# EAGLE design YosanoLoveButton (EAGLE 7.7.0)
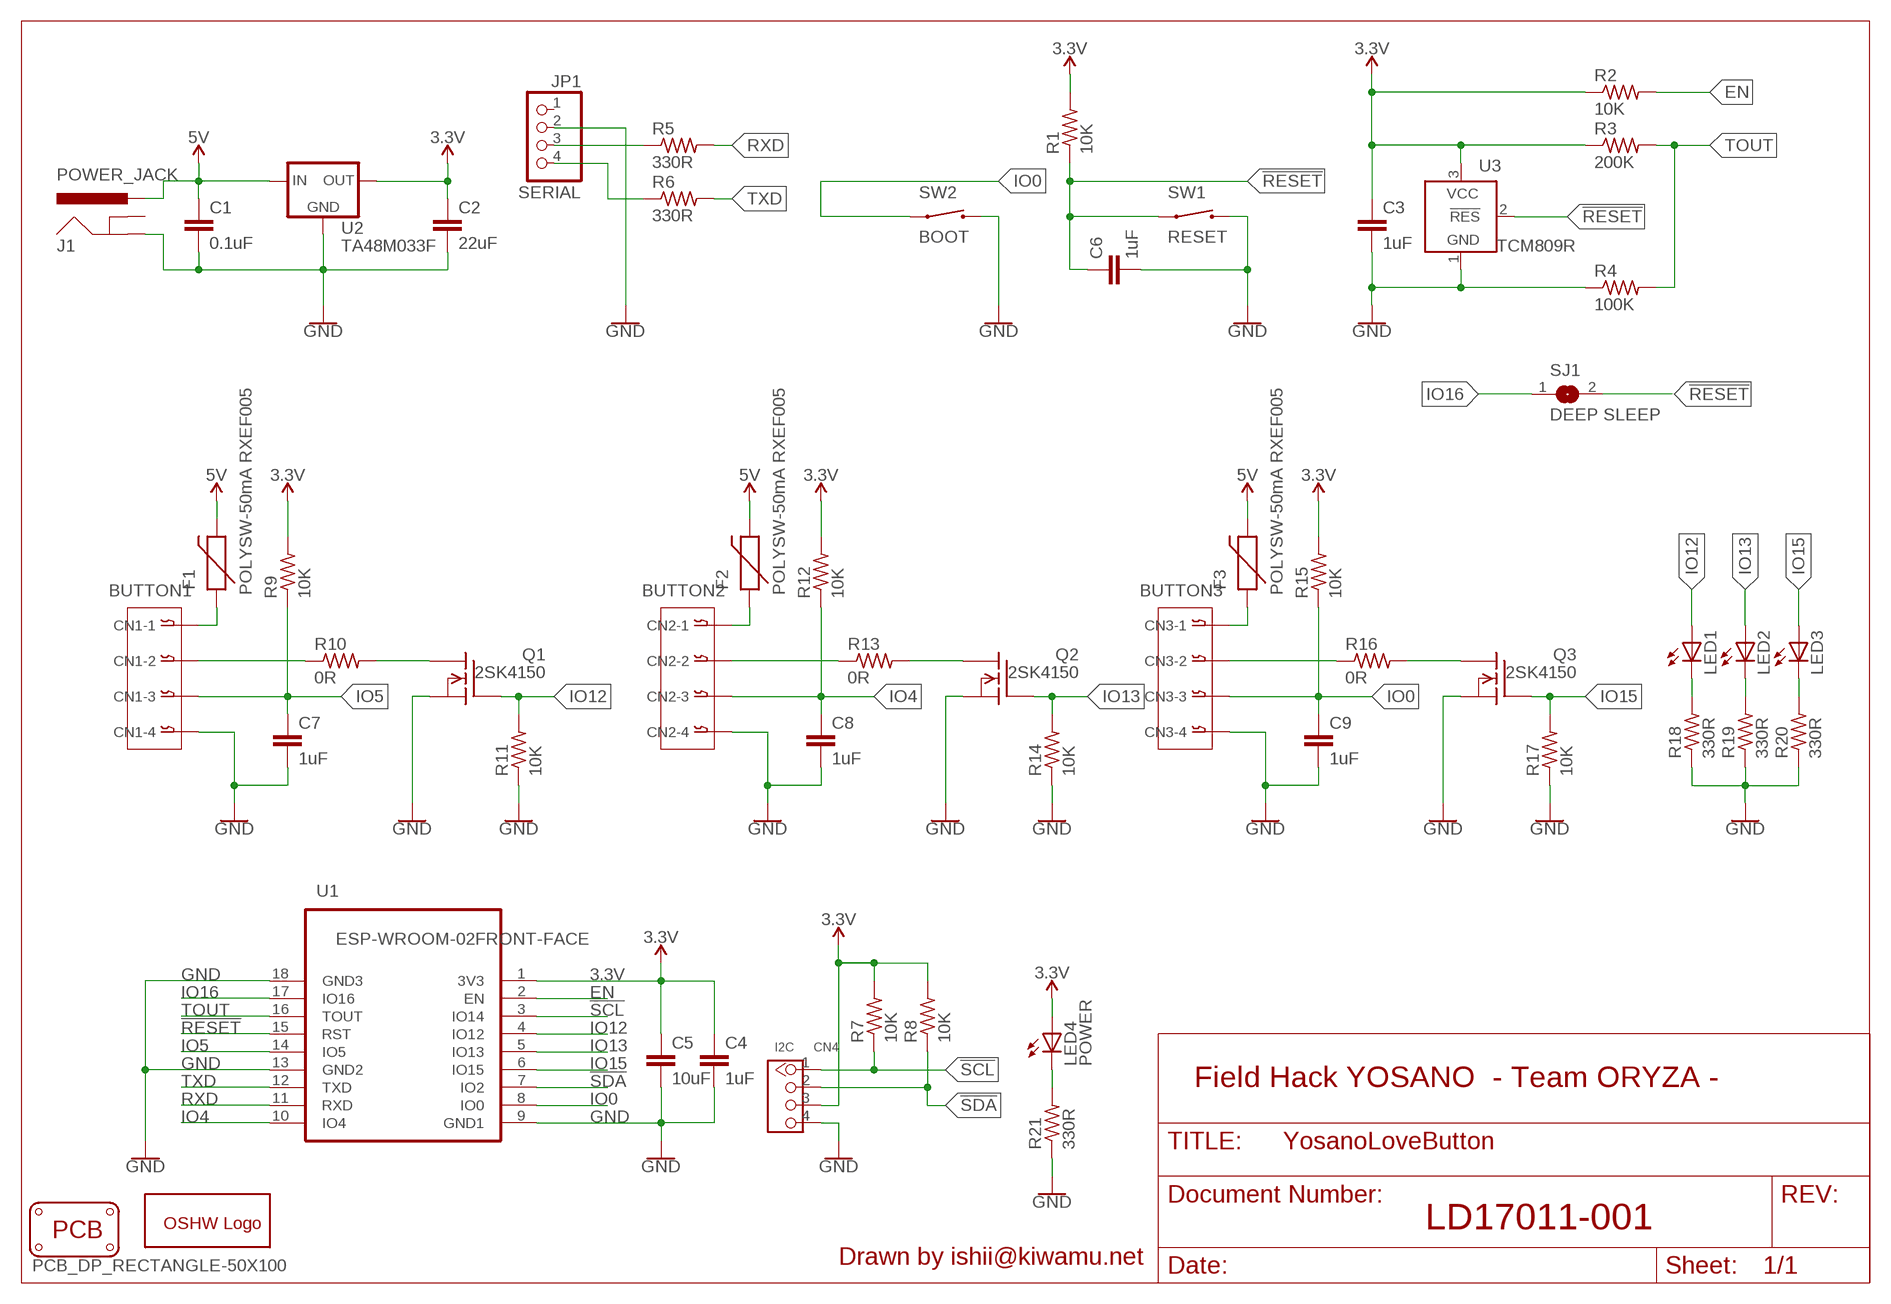
[diagram p0: schematic, sheet 1]

## Parts
C1  0.1uF  C5/2.5  [C5B2.5]
C2  22uF  C5/2.5  [C5B2.5]
C3  1uF  C5/2.5  [C5B2.5]
C4  1uF  C5/2.5  [C5B2.5]
C5  10uF  C5/2.5  [C5B2.5]
C6  1uF  C5/2.5  [C5B2.5]
C7  1uF  C5/2.5  [C5B2.5]
C8  1uF  C5/2.5  [C5B2.5]
C9  1uF  C5/2.5  [C5B2.5]
CN1  BUTTON1  04-JST-B4B-XH-A  [B4B-XH]
CN2  BUTTON2  04-JST-B4B-XH-A  [B4B-XH]
CN3  BUTTON3  04-JST-B4B-XH-A  [B4B-XH]
CN4  I2C  GROVE-CONNECTOR-DIP(4P-2.0)  [HW4-2.0]
F1  POLYSW-50mA RXEF005  PTCPTH  [PTC]
F2  POLYSW-50mA RXEF005  PTCPTH  [PTC]
F3  POLYSW-50mA RXEF005  PTCPTH  [PTC]
GOLD_ORB_SM1  OSHWLOGOLOGO5MM  [OSHW_5MM]
J1  POWER_JACK  [POWER_JACK_PTH]
JP1  SERIAL  PINHD-1X4  [1X04]
LED1  LED3MM  [LED3MM]
LED2  LED3MM  [LED3MM]
LED3  LED3MM  [LED3MM]
LED4  POWER  LED3MM  [LED3MM]
PCB1  PCB_DP_RECTANGLE-50X100  [DP10050_V1]
Q1  2SK4150  BSS101  [TO92]
Q2  2SK4150  BSS101  [TO92]
Q3  2SK4150  BSS101  [TO92]
R1  10K  R-US_0204/7  [0204/7]
R2  10K  R-US_0204/7  [0204/7]
R3  200K  R-US_0204/7  [0204/7]
R4  100K  R-US_0204/7  [0204/7]
R5  330R  R-US_0204/7  [0204/7]
R6  330R  R-US_0204/7  [0204/7]
R7  10K  R-US_0204/7  [0204/7]
R8  10K  R-US_0204/7  [0204/7]
R9  10K  R-US_0204/7  [0204/7]
R10  0R  R-US_0204/7  [0204/7]
R11  10K  R-US_0204/7  [0204/7]
R12  10K  R-US_0204/7  [0204/7]
R13  0R  R-US_0204/7  [0204/7]
R14  10K  R-US_0204/7  [0204/7]
R15  10K  R-US_0204/7  [0204/7]
R16  0R  R-US_0204/7  [0204/7]
R17  10K  R-US_0204/7  [0204/7]
R18  330R  R-US_0204/7  [0204/7]
R19  330R  R-US_0204/7  [0204/7]
R20  330R  R-US_0204/7  [0204/7]
R21  330R  R-US_0204/7  [0204/7]
SJ1  DEEP SLEEP  SOLDERJUMPERREFLOW  [SOLDERJUMPER_REFLOW]
SW1  RESET  TVBP06  [TVBP06]
SW2  BOOT  TVBP06  [TVBP06]
U1  ESP-WROOM-02FRONT-FACE  [FRONT-FACE]
U2  TA48M033F  [DPACK]
U3  TCM809R  TCM809  [SOT23B-3]

## Nets
3.3V [pwr]: C2.1 C3.1 C4.1 C5.1 CN4.3 LED4.A R1.2 R2.1 R3.1 R7.2 R8.2 R9.2 R12.2 R15.2 U1.1(3V3) U2.3(OUT) U3.3(VCC)
5V [pwr]: C1.1 F1.P$2 F2.P$2 F3.P$2 J1.PWR U2.1(IN)
!RESET: C6.1 R1.1 SJ1.2 SW1.1 U1.15(RST) U3.2(!RES)
!SCL: CN4.1 R7.1 U1.3(IO14)
!SDA: CN4.2 R8.1 U1.7(IO2)
EN: R2.2 U1.2(EN)
GND [gnd]: C1.2 C2.2 C3.2 C4.2 C5.2 C6.2 C7.2 C8.2 C9.2 CN1.P$4 CN2.P$4 CN3.P$4 CN4.4 J1.GND JP1.2 Q1.1(S) Q2.1(S) Q3.1(S) R4.1 R11.1 R14.1 R17.1 R18.1 R19.1 R20.1 R21.1 SW1.2 SW2.2 U1.9(GND1) U1.13(GND2) U1.18(GND3) U2.4(GND) U3.1(GND)
IO0: C9.1 CN3.P$3 R15.1 SW2.1 U1.8(IO0)
IO4: C8.1 CN2.P$3 R12.1 U1.10(IO4)
IO5: C7.1 CN1.P$3 R9.1 U1.14(IO5)
IO12: LED1.A Q1.2(G) R11.2 U1.4(IO12)
IO13: LED2.A Q2.2(G) R14.2 U1.5(IO13)
IO15: LED3.A Q3.2(G) R17.2 U1.6(IO15)
IO16: SJ1.1 U1.17(IO16)
N$1: LED1.K(C) R18.2
N$2: LED4.K(C) R21.2
N$3: JP1.4 R6.1
N$4: Q1.3(D) R10.2
N$5: JP1.3 R5.1
N$6: LED2.K(C) R19.2
N$7: LED3.K(C) R20.2
N$8: CN1.P$1 F1.P$1
N$9: CN1.P$2 R10.1
N$11: Q2.3(D) R13.2
N$12: CN2.P$1 F2.P$1
N$13: CN2.P$2 R13.1
N$15: Q3.3(D) R16.2
N$18: CN3.P$1 F3.P$1
N$19: CN3.P$2 R16.1
RXD: R5.2 U1.11(RXD)
TOUT: R3.2 R4.2 U1.16(TOUT)
TXD: R6.2 U1.12(TXD)
Unconnected: J1.GNDBREAK JP1.1

## Notes on the sheet
- Field Hack YOSANO  - Team ORYZA -
- LD17011-001
- Drawn by ishii@kiwamu.net

## Library data of the parts
C1-C9 = capacitor-wima:C: CAPACITOR naming: grid - package width
CN1-CN3 = bt_con-jst-xh:04-JST: JST CONNECTOR
CN4 = Seeed-Connector -2016:GROVE-CONNECTOR-DIP(4P-2.0): 320110033; VALUE: 4P-2.0
F1-F3 = bt:PTC: Resettable Fuse PTC Resettable Fuse. Spark Fun Electronics SKU : COM-08357
GOLD_ORB_SM1 = oshw:OSHWLOGO: The OSHW logo for PCB layout
J1 = SparkFun-Connectors:POWER_JACK: Power Jack Connector This is the standard 5.5mm barrel jack for power. The PTH is the most common, proven, reliable, footprint. The Slot footprint only works if the mill layer is transmitted to the PCB fab house so be warned. Here are the connectors we sell at SparkFun: DC Barrel Power Jack/Connector <https://www.sparkfun.com/products/119> (PRT-00119) DC Barrel Power Jack/Connector (SMD) <https://www.sparkfun.com/products/12748> (PRT-12748) DC Barrel Jack Adapter - Breadboard Compatible <https://www.sparkfun.com/products/10811> (PRT-10811) It is used on this SparkFun product (and many, many others): SparkFun RedBoard - Programmed with Arduino <https://www.sparkfun.com/products/12757> (DEV-12757) Also, if you need a mating power supply or connector, please check these out: Wall Adapter Power Supply - 9VDC 650mA <https://www.sparkfun.com/products/298> (TOL-00298) DC Barrel Jack Adapter - Male <https://www.sparkfun.com/products/10287> (PRT-10287); PROD_ID: CONN-08197
JP1 = pinhead:PINHD-1X4: PIN HEADER
LED1-LED4 = adafruit:LED: LED OSRAM: - CHIPLED LG R971, LG N971, LY N971, LG Q971, LY Q971, LO R971, LY R971 LH N974, LH R974 LS Q976, LO Q976, LY Q976 LO Q996 - Hyper CHIPLED LW Q18S LB Q993, LB Q99A, LB R99A - SideLED LS A670, LO A670, LY A670, LG A670, LP A670 LB A673, LV A673, LT A673, LW A673 LH A674 LY A675 LS A676, LA A676, LO A676, LY A676, LW A676 LS A679, LY A679, LG A679 - Hyper Micro SIDELED® LS Y876, LA Y876, LO Y876, LY Y876 LT Y87S - SmartLED LW L88C, LW L88S LB L89C, LB L89S, LG L890 LS L89K, LO L89K, LY L89K LS L896, LA L896, LO L896, LY L896 - TOPLED LS T670, LO T670, LY T670, LG T670, LP T670 LSG T670, LSP T670, LSY T670, LOP T670, LYG T670 LG T671, LOG T671, LSG T671 LB T673, LV T673, LT T673, LW T673 LH T674 LS T676, LA T676, LO T676, LY T676, LB T676, LH T676, LSB T676, LW T676 LB T67C, LV T67C, LT T67C, LS T67K, LO T67K, LY T67K, LW E67C LS E67B, LA E67B, LO E67B, LY E67B, LB E67C, LV E67C, LT E67C LW T67C LS T679, LY T679, LG T679 LS T770, LO T770, LY T770, LG T770, LP T770 LB T773, LV T773, LT T773, LW T773 LH T774 LS E675, LA E675, LY E675, LS T675 LS T776, LA T776, LO T776, LY T776, LB T776 LHGB T686 LT T68C, LB T68C - Hyper Mini TOPLED® LB M676 - Mini TOPLED Santana® LG M470 LS M47K, LO M47K, LY M47K Source: http://www.osram.convergy.de/
PCB1 = dp_pcb:PCB_DP_RECTANGLE: Dangerous Prototypes Standard Rectangular PCB sizes
Q1-Q3 = transistor-fet:BSS101: N-Channel Enhancement MOSFET 200V; 0,16A; 11Ohm
R1-R21 = resistor:R-US_: RESISTOR, American symbol
SJ1 = microbuilder:SOLDERJUMPER: SMD Solder JUMPER Solder the two pads together to create a connection, or remove the solder to break it. REFLOW - Use this footprint for solder paste and reflow ovens. WAVE - Use this footprint for hand-soldering (larger pads). CLOSED - Has a trace between the two pads to ensure it is closed by default. The trace needs to be cut to disable the jumper, and can be closed again by creating a solder bridge between the two pads.
SW1 SW2 = switches:TVBP06: 2pin switch. http://akizukidenshi.com/catalog/g/gP-08074/
U1 = esp-wroom-02:ESP-WROOM-02: WiFi module - ESP-WROOM-02
U2 = BS21Lab-Regulators:TA48?*: TA48 series
U3 = telcom:TCM809: POWER SUPPLY MONITOR replacement for Maxim MAX809 and MAX810; MF: MICROCHIP; MPN: TCM809MENB713; OC_FARNELL: 9762744; OC_NEWARK: 96K3998

## Net classes
0 default: width 0.406 mm, drill 0.305 mm, clearance 0.254 mm
1 gnd: width 0.635 mm, drill 0.635 mm, clearance 0.305 mm
2 pwr: width 0.559 mm, drill 0.559 mm, clearance 0.254 mm

## Board
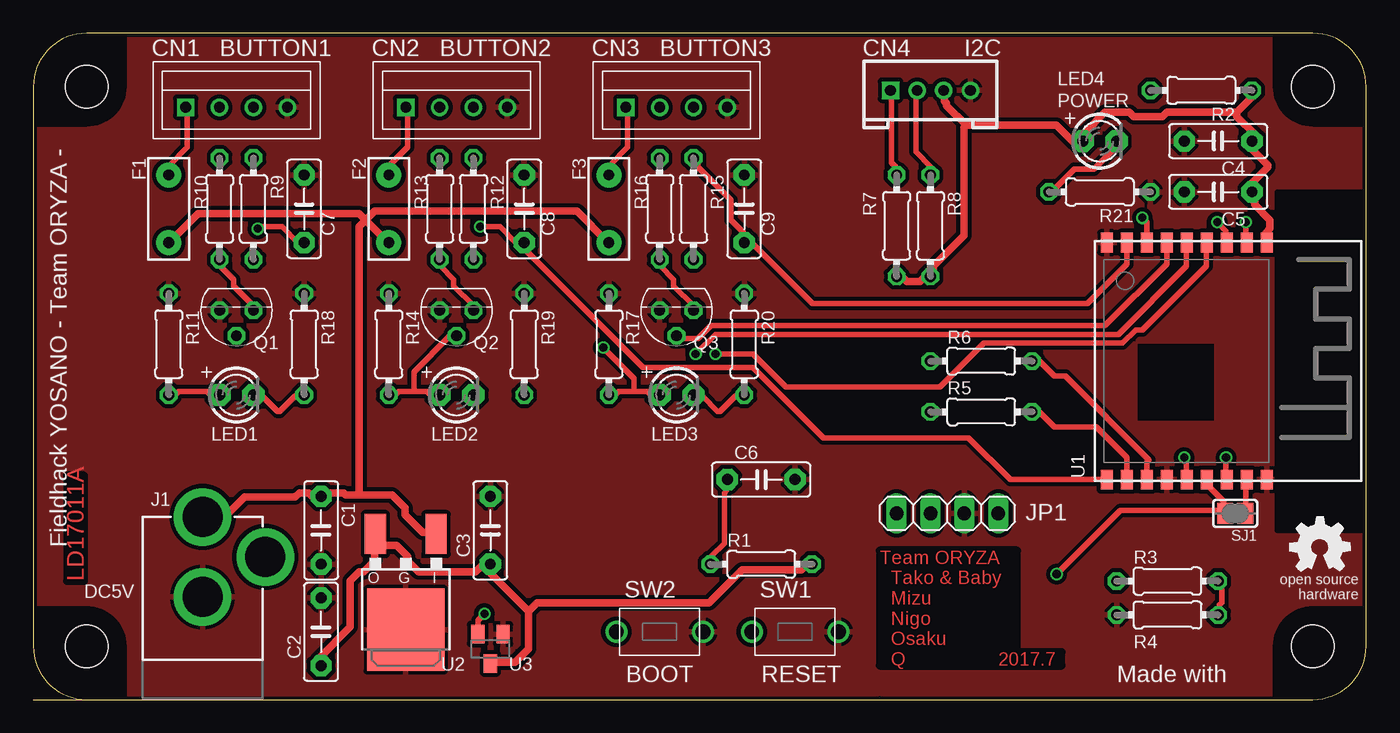
[diagram p1: board, top side]
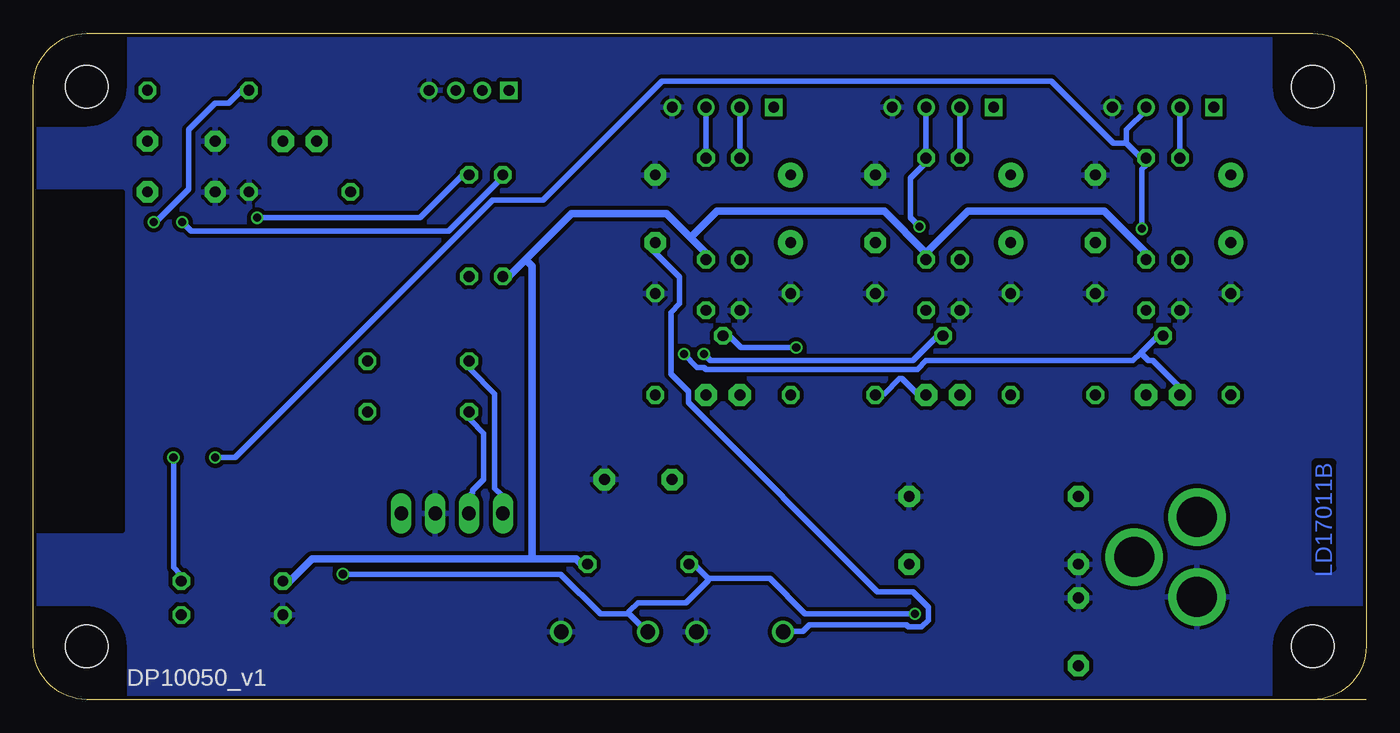
[diagram p2: board, bottom side, seen from below]

Size 100 x 50 mm. Coordinates in mm from the lower left corner, seen from the top.
Outline: 0,0 63.5,0
Copper layers (1*16): Top 0.035mm / dielectric 1.5mm / Bottom 0.035mm
Design rules "SeeedStudio_2layer_DRU_no_angle_20140221": minimum track width 6mil, minimum drill 12mil, track to track 6mil, track to pad 6mil, pad to pad 6mil, via to via 6mil, smd to smd 0mil, copper to edge 10mil, drill to drill 10mil, minimum pad ring 10mil, minimum via ring 6mil, stop-mask expansion 2mil, vias tented up to drill 100mil, thermal gap 10mil
tRestrict: area 93.3,12.7 to 99.7,38.1
bRestrict: area 93.3,12.7 to 99.7,38.1

### Footprints (pad centres in the part's own frame; a part is rotated, then mirrored left to right if it is on the bottom)
C5B2.5 = drill 0.813 pad 1.6 octagon: 1 -2.54,0; 2 2.54,0
B4B-XH = drill 0.8 square: P$1 -3.81,0 | drill 0.8: P$2 -1.27,0; P$3 1.27,0; P$4 3.81,0
HW4-2.0 = drill 0.8 pad 1.27 square: 1 -3,0 | drill 0.8 pad 1.27: 2 -1,0; 3 1,0; 4 3,0
PTC = drill 0.8 pad 1.88: P$1 -2.54,0; P$2 2.54,0
POWER_JACK_PTH = drill 2.997 pad 4.318: GND 0,7.7; GNDBREAK 4.7,10.7; PWR 0,13.7
1X04 = drill 1.016 long: 1 -3.81,0; 2 -1.27,0; 3 1.27,0; 4 3.81,0
LED3MM = drill 0.813 pad 1.676 octagon: A -1.27,0; K 1.27,0
DP10050_V1 = hole 3.2: 4,4; 96,4; 96,46; 4,46
TO92 = drill 0.813 octagon: 1 1.27,0; 2 0,1.905; 3 -1.27,0
0204/7 = drill 0.813 octagon: 1 -3.81,0; 2 3.81,0
SOLDERJUMPER_REFLOW = smd 1.168 x 1.6: 1 -0.762,0; 2 0.762,0
TVBP06 = drill 1.1: 1 -3.25,0; 2 3.25,0
FRONT-FACE = smd 1.485 x 0.9: 1 -8.893,4.9; 2 -8.893,3.4; 3 -8.893,1.9; 4 -8.893,0.4; 5 -8.893,-1.1; 6 -8.893,-2.6; 7 -8.893,-4.1; 8 -8.893,-5.6; 9 -8.893,-7.1; 10 8.893,-7.1; 11 8.893,-5.6; 12 8.893,-4.1; 13 8.893,-2.6; 14 8.893,-1.1; 15 8.893,0.4; 16 8.893,1.9; 17 8.893,3.4; 18 8.893,4.9
DPACK = smd 1.6 x 3: 1 -2.28,-4.8; 3 2.28,-4.8 | smd 5.8 x 6.2: 4 0,2.38
SOT23B-3 = smd 1 x 1.4: 1 -0.95,-1.1; 2 0.95,-1.1; 3 0,1.1

### Placement (x,y rotation side)
C1  21.59,12.7 270 top
C2  21.59,5.08 90 top
C3  34.29,12.7 90 top
C4  88.9,41.91 180 top
C5  88.9,38.1 180 top
C6  54.61,16.51 0 top
C7  20.32,36.83 90 top
C8  36.83,36.83 90 top
C9  53.34,36.83 90 top
CN1  15.24,44.45 0 top
CN2  31.75,44.45 0 top
CN3  48.26,44.45 0 top
CN4  67.31,45.72 0 top
F1  10.16,36.83 270 top
F2  26.67,36.83 270 top
F3  43.18,36.83 270 top
GOLD_ORB_SM1  96.52,11.43 0 top
J1  12.7,0 0 top
JP1  68.58,13.97 180 top
LED1  15.24,22.86 0 top
LED2  31.75,22.86 0 top
LED3  48.26,22.86 0 top
LED4  80.01,41.91 0 top
PCB1  0,0 0 top
Q1  15.24,29.21 180 top
Q2  31.75,29.21 180 top
Q3  48.26,29.21 180 top
R1  54.61,10.16 0 top
R2  87.63,45.72 180 top
R3  85.09,8.89 0 top
R4  85.09,6.35 0 top
R5  71.12,21.59 0 top
R6  71.12,25.4 0 top
R7  64.77,35.56 270 top
R8  67.31,35.56 270 top
R9  16.51,36.83 270 top
R10  13.97,36.83 270 top
R11  10.16,26.67 270 top
R12  33.02,36.83 270 top
R13  30.48,36.83 270 top
R14  26.67,26.67 270 top
R15  49.53,36.83 270 top
R16  46.99,36.83 270 top
R17  43.18,26.67 270 top
R18  20.32,26.67 270 top
R19  36.83,26.67 270 top
R20  53.34,26.67 270 top
R21  80.01,38.1 180 top
SJ1  90.17,13.97 180 top
SW1  57.15,5.08 0 top
SW2  46.99,5.08 0 top
U1  87.63,25.4 270 top
U2  27.94,7.62 180 top
U3  34.29,3.81 180 top

### Tracks (layer width: path | path; a pad name or v marks a point on that pad's centre or on a via)
3.3V
  Top 0.559: C2.1 21.46,2.64 21.46,3.14 23.77,5.45 23.77,8.91 24.43,9.58 24.77,9.58 25.59,10.4 25.59,12.38 U2.3 25.76,11.56 27.24,11.56 28.07,10.73 28.07,10.4 28.89,9.58 33.19,9.58 33.68,10.07 34.01,10.07 C3.1 34.18,10.07 34.18,9.58 37.15,6.6 | 37.15,6.6 37.15,3.8 36.16,2.81 34.34,2.81 U3.3 | 37.15,6.6 37.81,7.26 50.69,7.26 53.16,9.74 57.62,9.74 57.95,10.07 58.28,10.07 R1.2 | U1.1 92.46,34.34 92.46,35 92.79,35.33 92.79,35.99 91.63,37.15 91.63,37.31 91.47,37.48 91.47,37.97 C5.1 91.47,38.3 91.47,38.8 92.62,39.95 92.62,40.12 91.47,41.27 91.47,41.77 C4.1 91.63,42.1 91.63,42.43 90.31,43.75 90.31,44.08 | 90.31,44.08 91.47,45.24 91.47,45.57 R2.1 | 70,43.09 68.52,44.58 68.52,44.74 68.35,44.91 68.35,45.57 CN4.3 | 70,43.09 76.77,43.09 78.09,41.77 78.59,41.77 LED4.A 78.92,42.1 78.92,42.6 80.4,44.08 82.22,44.08 82.55,43.75 84.7,43.75 85.03,44.08 90.31,44.08 | R7.2 64.88,31.7 65.22,31.7 65.55,31.37 66.53,31.37 66.86,31.7 67.2,31.7 R8.2 67.03,31.86 67.53,32.36 67.53,32.52 69.84,34.84 69.84,42.93 70,43.09
  Bottom 0.559: 62.57,10.57 59.27,10.57 58.94,10.24 58.45,10.24 R1.2 | 62.57,10.57 79.08,10.57 80.73,8.91 81.23,8.91 R3.1 | R9.2 16.51,33.52 19.65,36.65 29.88,36.65 33.02,33.52 | R12.2 33.02,33.52 | R15.2 49.53,33.52 50.69,34.67 | 50.69,34.67 52.5,36.49 59.6,36.49 63.07,33.02 | 63.07,33.02 64.22,31.86 64.72,31.86 R7.2 | 33.02,33.52 36.16,36.65 48.7,36.65 50.69,34.67 | 62.57,10.57 62.57,32.52 63.07,33.02
5V
  Top 0.559: 24.43,15.35 23.44,15.35 23.28,15.52 22.29,15.52 22.12,15.35 21.63,15.35 C1.1 21.46,15.19 20.97,15.19 20.64,15.52 19.98,15.52 19.65,15.19 15.85,15.19 14.36,13.7 12.71,13.7 J1.PWR | 24.43,15.35 26.91,15.35 27.9,14.36 27.9,13.87 29.22,12.55 30.21,12.55 U2.1 | 24.93,35.99 26.58,34.34 F2.P$2 | 24.93,35.99 24.43,36.49 12.38,36.49 10.24,34.34 F1.P$2 | 24.93,35.99 25.59,36.65 40.78,36.65 43.09,34.34 F3.P$2 | 24.43,15.35 24.43,35.5 24.93,35.99
!RESET  (via drill 0.61)
  Top 0.406: v33.85,6.44 33.35,5.94 33.35,4.95 U3.2 | C6.1 52.01,16.51 52.01,15.68 51.84,15.52 51.84,11.72 50.85,10.73 50.85,10.24 R1.1 | U1.15 88.16,16.34 88.16,16.02 89.32,14.86 89.32,14.03 SJ1.2 89.15,14.2 81.56,14.2 v76.77,9.41
  Bottom 0.406: v33.85,6.44 42.1,6.44 44.74,9.08 49.37,9.08 | 49.37,9.08 50.35,10.07 50.69,10.07 R1.1 | v76.77,9.41 60.43,9.41 57.45,6.44 55.31,6.44 | 55.31,6.44 53.99,5.12 SW1.1 | 49.37,9.08 49.37,8.91 51.02,7.26 54.65,7.26 55.31,6.6 55.31,6.44
!SCL  (via drill 0.61)
  Top 0.406: v88.82,35.83 89.48,35.17 89.48,34.34 U1.3 | CN4.1 64.39,45.57 64.39,40.28 64.72,39.95 64.72,39.46 R7.1
  Bottom 0.406: v88.82,35.83 88.16,35.17 68.85,35.17 64.72,39.29 R7.1
!SDA  (via drill 0.61)
  Top 0.406: v83.21,36.16 83.54,35.83 83.54,34.34 U1.7 | CN4.2 66.2,45.57 66.2,41.11 67.36,39.95 67.36,39.46 R8.1
  Bottom 0.406: v83.21,36.16 70.99,36.16 67.86,39.29 67.36,39.29 R8.1
EN  (via drill 0.61)
  Top 0.406: v90.97,35.83 90.97,34.34 U1.2
  Bottom 0.406: v90.97,35.83 90.81,35.83 88.33,38.3 88.33,42.76 86.35,44.74 85.36,44.74 84.37,45.73 83.87,45.73 R2.2
GND
  pour Bottom: 0,49.53 100.33,49.53 100.33,0 0,0
  pour Top: 0,49.53 100.33,49.53 100.33,0 0,0
IO0
  Top 0.406: 49.53,44.25 CN3.P$3 | 49.37,41.11 49.37,40.95 49.53,40.78 R15.1 49.53,40.45 49.86,40.12 49.86,39.95 52.34,37.48 52.34,35.99 53.33,35 53.33,34.34 C9.1 53.49,34.18 53.99,34.18 58.45,29.72 79.08,29.72 82.06,32.69 82.06,34.18 U1.8
  Bottom 0.406: SW2.1 43.59,5.12 42.27,5.12 41.77,5.61 34.51,5.61 34.34,5.45 33.35,5.45 32.85,5.94 32.85,6.93 34.01,8.09 36.65,8.09 50.85,22.29 50.85,23.11 52.17,24.43 52.17,29.06 51.51,29.72 51.51,31.7 53.49,33.68 53.49,34.18 C9.1 | R15.1 CN3.P$3
IO4  (via drill 0.61)
  Top 0.406: 33.02,44.25 CN2.P$3 | 32.85,41.11 32.85,40.95 33.02,40.78 R12.1 | U1.10 80.4,16.51 73.3,16.51 70.17,19.65 59.27,19.65 53.99,24.93 45.73,24.93 36.98,33.68 36.98,34.18 C8.1 36.65,34.34 36.16,34.34 35,35.5 v33.52,35.5
  Bottom 0.406: v33.52,35.5 34.18,36.16 34.18,39.13 33.02,40.28 R12.1 CN2.P$3
IO5  (via drill 0.61)
  Top 0.406: v86.35,18.16 86.51,18 86.51,16.51 U1.14 | v16.84,35.33 17,35.5 18.66,35.5 19.81,34.34 20.31,34.34 C7.1
  Bottom 0.406: v86.35,18.16 84.86,18.16 65.55,37.48 61.75,37.48 52.83,46.39 23.61,46.39 18.99,41.77 18,41.77 | 18,41.77 17,40.78 16.51,40.78 R9.1 16.51,40.12 16.84,39.79 v16.84,35.33 | CN1.P$3 16.51,44.25 18,42.76 18,41.77
IO12  (via drill 0.61)
  Top 0.406: R11.2 10.24,22.95 10.73,22.95 10.9,23.11 13.04,23.11 13.21,22.95 13.87,22.95 LED1.A | v51.18,25.92 53.99,25.92 56.46,23.44 68.02,23.44 71.32,26.75 81.72,26.75 82.72,27.74 83.21,27.74 88,32.52 88,34.18 U1.4
  Bottom 0.406: v51.18,25.92 50.19,24.93 49.7,24.93 49.53,24.77 33.68,24.77 33.02,25.43 17.5,25.43 16.92,26 | 16.92,26 15.68,27.24 15.35,27.24 Q1.2 | 16.92,26 16.34,25.43 16.02,25.43 14.03,23.44 14.03,22.95 LED1.A
IO13  (via drill 0.61)
  Top 0.406: 28.56,23.11 29.55,23.11 29.72,22.95 30.38,22.95 LED2.A | 28.56,23.11 27.41,23.11 27.24,22.95 26.75,22.95 R14.2 | v49.7,25.92 51.18,27.41 81.39,27.41 86.51,32.52 86.51,34.18 U1.5 | 28.56,23.11 28.56,24.6 31.2,27.24 31.7,27.24 Q2.2
  Bottom 0.406: v49.7,25.92 49.2,25.43 34.01,25.43 32.19,27.24 31.86,27.24 Q2.2
IO15  (via drill 0.61)
  Top 0.406: 45.07,23.11 46.06,23.11 46.23,22.95 46.89,22.95 LED3.A | 45.07,23.11 43.92,23.11 43.75,22.95 43.26,22.95 R17.2 | U1.6 85.03,34.18 85.03,32.69 80.4,28.07 50.85,28.07 49.86,27.08 48.87,27.08 48.7,27.24 48.37,27.24 Q3.2 | 45.07,23.11 45.07,24.11 v42.76,26.42
  Bottom 0.406: v42.76,26.42 46.89,26.42 47.71,27.24 48.21,27.24 Q3.2
IO16
  Top 0.406: U1.17 90.97,16.34 90.97,14.03 SJ1.1
N$1
  Top 0.406: R18.2 20.31,22.78 19.65,22.78 18.49,21.63 18.33,21.63 17.17,22.78 16.51,22.78 LED1.K
N$2
  Top 0.406: R21.2 76.28,38.14 76.44,38.14 78.09,39.79 79.58,39.79 81.23,41.44 81.23,41.77 LED4.K
N$3
  Bottom 0.406: R6.1 67.2,25.26 67.2,24.77 65.38,22.95 65.38,15.85 64.88,15.35 64.88,14.03 JP1.4
N$4
  Top 0.406: Q1.3 16.51,29.55 15.02,31.04 15.02,31.53 14.03,32.52 14.03,33.02 R10.2
N$5
  Bottom 0.406: R5.1 67.2,21.46 67.2,20.97 66.2,19.98 66.2,16.51 67.03,15.68 67.03,15.52 67.2,15.35 67.2,14.03 JP1.3
N$6
  Bottom 0.406: R19.2 36.82,22.95 36.16,22.95 35,24.11 34.84,24.11 33.68,22.95 33.02,22.95 LED2.K
N$7
  Top 0.406: R20.2 53.33,22.78 52.67,22.78 51.51,21.63 51.35,21.63 50.19,22.78 49.53,22.78 LED3.K
N$8
  Top 0.406: CN1.P$1 11.56,44.41 11.56,41.44 10.24,40.12 10.24,39.46 F1.P$1
N$9
  Top 0.406: 14.03,44.25 14.03,44.41 CN1.P$2 | 14.03,41.11 14.03,40.78 R10.1
  Bottom 0.406: R10.1 CN1.P$2
N$11
  Top 0.406: Q2.3 33.02,29.55 31.53,31.04 31.53,31.53 30.54,32.52 30.54,33.02 R13.2
N$12
  Top 0.406: CN2.P$1 28.07,44.41 28.07,41.44 26.75,40.12 26.75,39.46 F2.P$1
N$13
  Top 0.406: 30.54,44.25 30.54,44.41 CN2.P$2 | 30.54,41.11 30.54,40.78 R13.1
  Bottom 0.406: R13.1 CN2.P$2
N$15
  Top 0.406: Q3.3 49.53,29.55 48.04,31.04 48.04,31.53 47.05,32.52 47.05,33.02 R16.2
N$18
  Top 0.406: CN3.P$1 44.58,44.41 44.58,41.44 43.26,40.12 43.26,39.46 F3.P$1
N$19
  Top 0.406: 47.05,44.25 47.05,44.41 CN3.P$2 | 47.05,41.11 47.05,40.78 R16.1
  Bottom 0.406: R16.1 CN3.P$2
RXD
  Top 0.406: U1.11 82.06,16.51 82.06,18.16 79.74,20.47 76.61,20.47 75.45,21.63 74.95,21.63 R5.2
TOUT  (via drill 0.61)
  Top 0.406: v89.48,18.16 89.48,16.51 U1.16 | R4.2 88.99,6.44 88.99,7.1 89.15,7.26 89.15,8.26 88.99,8.42 88.99,8.75 R3.2
  Bottom 0.406: v89.48,18.16 89.48,9.91 88.99,9.41 88.99,8.91 R3.2
TXD
  Top 0.406: U1.12 83.54,17.83 83.71,18 77.43,24.27 76.61,24.27 75.45,25.43 74.95,25.43 R6.2

### Text on the board
Top: LD17011A | LD17011A | Team ORYZA / Tako & Baby / Mizu / Nigo / Osaku / Q | 2017.7
Bottom: LD17011B
tPlace: POWER
tNames: I2C | Fieldhack YOSANO - Team ORYZA - | DC5V | BOOT | RESET | Made with ♥